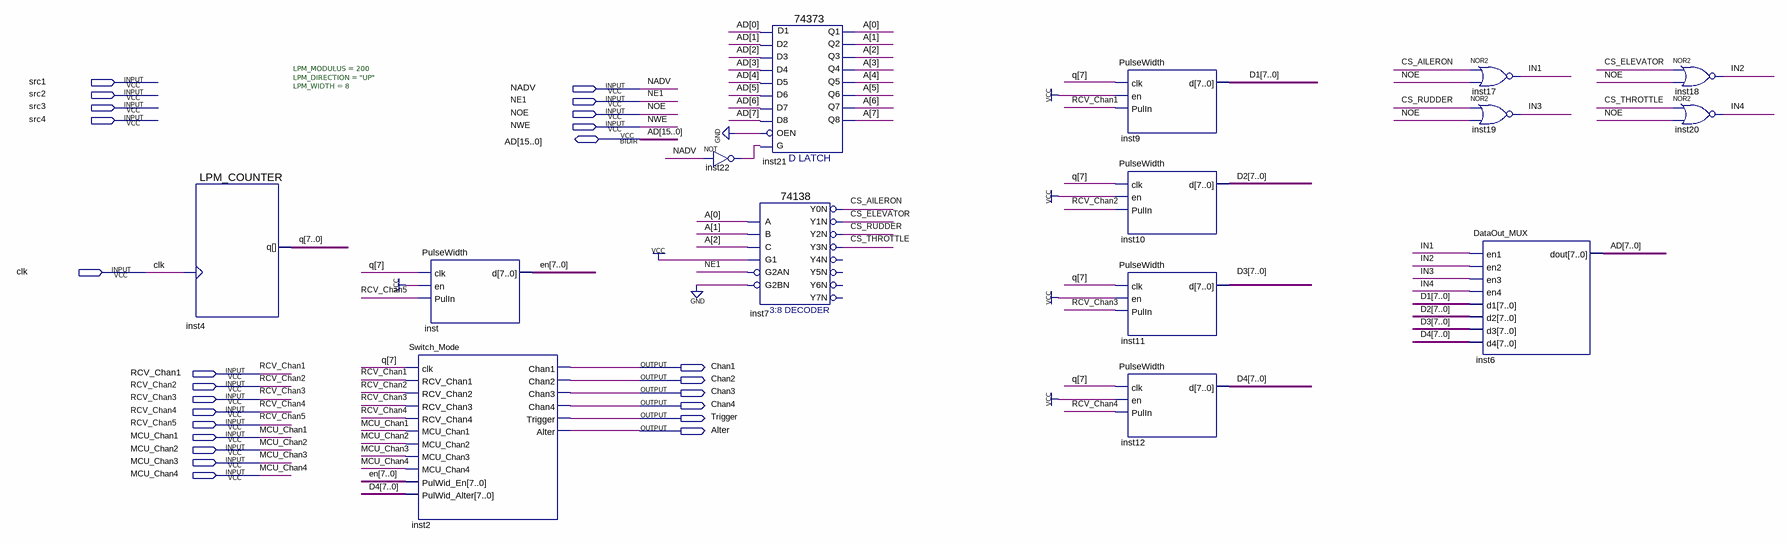
[diagram p0: schematic sheet]
// Quartus schematic Auto_manual.bdf as structural Verilog: 15 symbols, 25 pins
module Auto_manual (
  input  src1,
  input  NADV,
  input  src2,
  input  NE1,
  input  src3,
  input  NOE,
  input  src4,
  input  NWE,
  input  clk,
  input  RCV_Chan1,
  input  RCV_Chan2,
  input  RCV_Chan3,
  input  RCV_Chan4,
  input  RCV_Chan5,
  input  MCU_Chan1,
  input  MCU_Chan2,
  input  MCU_Chan3,
  input  MCU_Chan4,
  inout  [15:0] AD,
  output Chan1,
  output Chan2,
  output Chan3,
  output Chan4,
  output Trigger,
  output Alter
);

  wire CS_AILERON, CS_ELEVATOR, CS_RUDDER, CS_THROTTLE, IN1, IN2, IN3, IN4, inst22_out;
  wire [7:0] A, D1, D2, D3, D4, en, q;

  LPM_COUNTER #(.LPM_MODULUS(200), .LPM_DIRECTION("UP"), .LPM_WIDTH(8)) inst4 (.clock(clk), .q(q));
  PulseWidth inst (.clk(q[7]), .en(1'b1), .PulIn(RCV_Chan5), .d(en));
  Switch_Mode inst2 (
    .clk(q[7]), .RCV_Chan1(RCV_Chan1), .RCV_Chan2(RCV_Chan2), .RCV_Chan3(RCV_Chan3), .RCV_Chan4(RCV_Chan4),
    .MCU_Chan1(MCU_Chan1), .MCU_Chan2(MCU_Chan2), .MCU_Chan3(MCU_Chan3), .MCU_Chan4(MCU_Chan4),
    .PulWid_En(en), .PulWid_Alter(D4), .Chan1(Chan1), .Chan2(Chan2), .Chan3(Chan3), .Chan4(Chan4),
    .Trigger(Trigger), .Alter(Alter));
  not inst22 (inst22_out, NADV);
  \74373  inst21 (
    .D1(AD[0]), .D3(AD[2]), .D6(AD[5]), .D7(AD[6]), .D2(AD[1]), .G(inst22_out), .D4(AD[3]), .D5(AD[4]),
    .D8(AD[7]), .OEN(1'b0), .Q3(A[2]), .Q6(A[5]), .Q7(A[6]), .Q2(A[1]), .Q8(A[7]), .Q4(A[3]), .Q5(A[4]),
    .Q1(A[0]));
  \74138  inst7 (
    .A(A[0]), .B(A[1]), .G1(1'b1), .C(A[2]), .G2AN(NE1), .G2BN(1'b0), .Y0N(CS_AILERON), .Y1N(CS_ELEVATOR),
    .Y2N(CS_RUDDER), .Y3N(CS_THROTTLE));  // open: Y4N, Y5N, Y6N, Y7N
  PulseWidth inst9 (.clk(q[7]), .en(1'b1), .PulIn(RCV_Chan1), .d(D1));
  PulseWidth inst10 (.clk(q[7]), .en(1'b1), .PulIn(RCV_Chan2), .d(D2));
  PulseWidth inst11 (.clk(q[7]), .en(1'b1), .PulIn(RCV_Chan3), .d(D3));
  PulseWidth inst12 (.clk(q[7]), .en(1'b1), .PulIn(RCV_Chan4), .d(D4));
  nor inst17 (IN1, CS_AILERON, NOE);
  nor inst19 (IN3, CS_RUDDER, NOE);
  DataOut_MUX inst6 (.en1(IN1), .en2(IN2), .en3(IN3), .en4(IN4), .d1(D1), .d2(D2), .d3(D3), .d4(D4), .dout(AD[7:0]));
  nor inst18 (IN2, CS_ELEVATOR, NOE);
  nor inst20 (IN4, CS_THROTTLE, NOE);
endmodule
